# EAGLE design motor_servo_control (EAGLE 9.6.2)
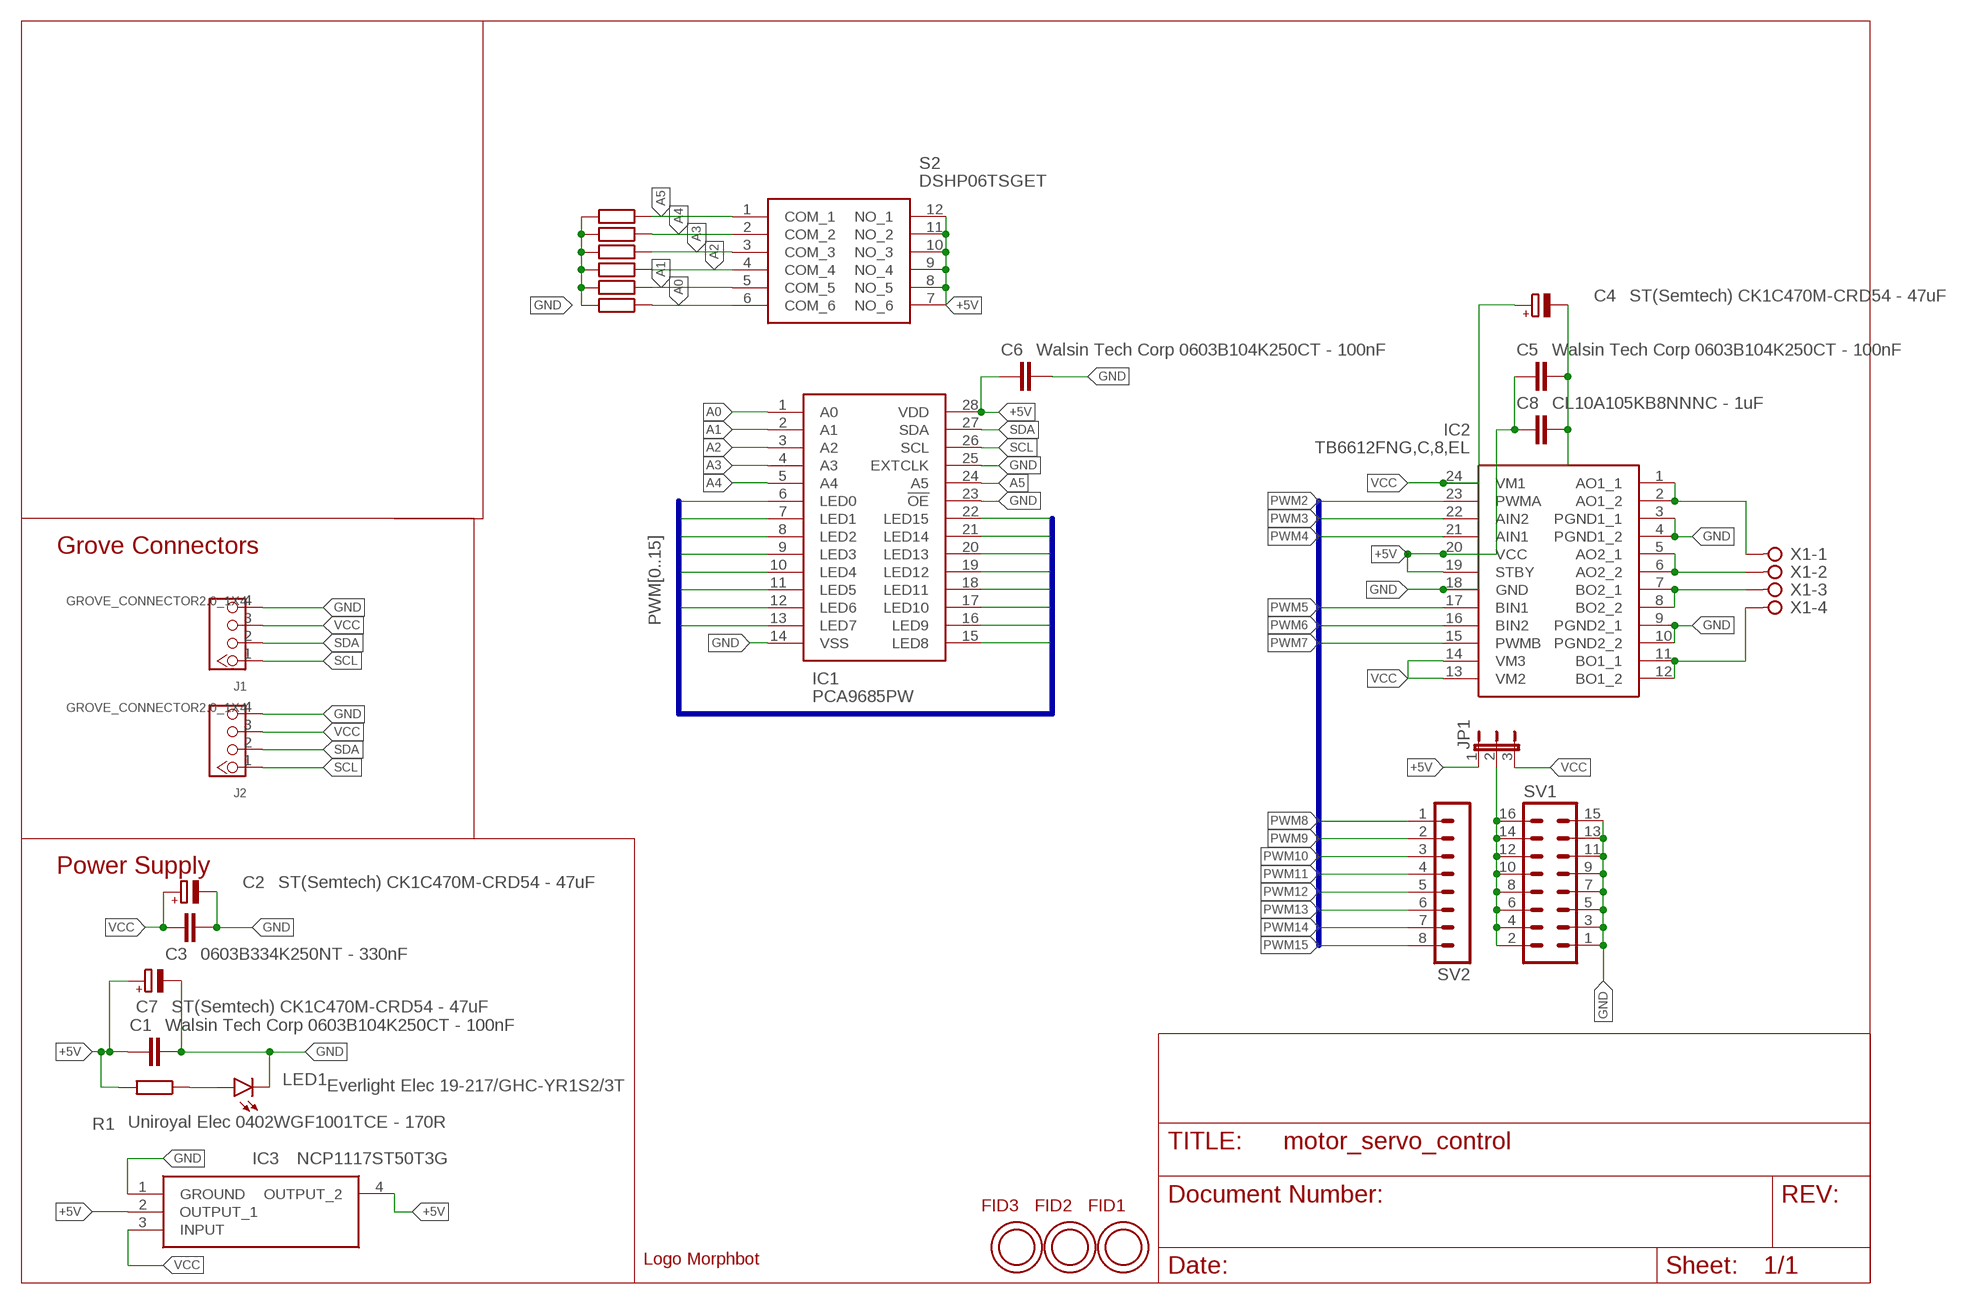
[diagram p0: schematic, sheet 1]

## Parts
C1  Walsin Tech Corp 0603B104K250CT - 100nF  C-EUC0603  [C0603]
C2  ST(Semtech) CK1C470M-CRD54 - 47uF  CPOL-EUC  [PANASONIC_C]
C3  0603B334K250NT - 330nF  C-EUC0603  [C0603]
C4  ST(Semtech) CK1C470M-CRD54 - 47uF  CPOL-EUC  [PANASONIC_C]
C5  Walsin Tech Corp 0603B104K250CT - 100nF  C-EUC0603  [C0603]
C6  Walsin Tech Corp 0603B104K250CT - 100nF  C-EUC0603  [C0603]
C7  ST(Semtech) CK1C470M-CRD54 - 47uF  CPOL-EUC  [PANASONIC_C]
C8  CL10A105KB8NNNC - 1uF  C-EUC0603  [C0603]
FID1  OPEN-PNP-FIDUCIAL  [OPEN-PNP-FIDUCIAL]
FID2  OPEN-PNP-FIDUCIAL  [OPEN-PNP-FIDUCIAL]
FID3  OPEN-PNP-FIDUCIAL  [OPEN-PNP-FIDUCIAL]
IC1  PCA9685PW  [SOP65P640X110-28N]
IC2  TB6612FNG,C,8,EL  [SOP65P760X160-24N]
IC3  NCP1117ST50T3G  [SOT230P700X180-4N]
J1  GROVE_CONNECTOR2.0_1X4  [2.0_1X4_STRAIGHT]
J2  GROVE_CONNECTOR2.0_1X4  [2.0_1X4_STRAIGHT]
JP1  JP2E  [JP2]
LED1  Everlight Elec 19-217/GHC-YR1S2/3T  LEDCHIPLED_0603  [CHIPLED_0603]
R1  Uniroyal Elec 0402WGF1001TCE - 170R  R-EU_R0402  [R0402]
R2  0402WGF1002TCE - 10k  R-EU_R0402  [R0402]
R3  0402WGF1002TCE - 10k  R-EU_R0402  [R0402]
R4  0402WGF1002TCE - 10k  R-EU_R0402  [R0402]
R5  0402WGF1002TCE - 10k  R-EU_R0402  [R0402]
R6  0402WGF1002TCE - 10k  R-EU_R0402  [R0402]
R7  0402WGF1002TCE - 10k  R-EU_R0402  [R0402]
S2  DSHP06TSGET  [DSHP06TSGET]
SV1  MA08-2  [MA08-2]
SV2  MA08-1  [MA08-1]
U$1  LOGO_MORPHBOT5MM  [LOGO_MORPHBOT]
X1  W237-04P  [W237-4P]

## Nets
+5V: C1.1 C5.1 C6.1 C7.+ C8.1 IC1.28(VDD) IC2.19(STBY) IC2.20(VCC) IC3.2(OUTPUT_1) IC3.4(OUTPUT_2) JP1.1 R1.2 S2.7(NO_6) S2.8(NO_5) S2.9(NO_4) S2.10(NO_3) S2.11(NO_2) S2.12(NO_1)
A0: IC1.1(A0) R7.1 S2.6(COM_6)
A1: IC1.2(A1) R6.1 S2.5(COM_5)
A2: IC1.3(A2) R5.1 S2.4(COM_4)
A3: IC1.4(A3) R4.1 S2.3(COM_3)
A4: IC1.5(A4) R3.1 S2.2(COM_2)
A5: IC1.24(A5) R2.1 S2.1(COM_1)
GND: C1.2 C2.- C3.1 C4.- C5.2 C6.2 C7.- C8.2 IC1.14(VSS) IC1.23(!OE) IC1.25(EXTCLK) IC2.3(PGND1_1) IC2.4(PGND1_2) IC2.9(PGND2_1) IC2.10(PGND2_2) IC2.18(GND) IC3.1(GROUND) J1.4 J2.4 LED1.C R2.2 R3.2 R4.2 R5.2 R6.2 R7.2 SV1.1 SV1.3 SV1.5 SV1.7 SV1.9 SV1.11 SV1.13 SV1.15
M1+: IC2.1(AO1_1) IC2.2(AO1_2) X1.1
M1-: IC2.5(AO2_1) IC2.6(AO2_2) X1.2
M2+: IC2.7(BO2_1) IC2.8(BO2_2) X1.3
M2-: IC2.11(BO1_1) IC2.12(BO1_2) X1.4
N$1: LED1.A R1.1
N$2: JP1.2 SV1.2 SV1.4 SV1.6 SV1.8 SV1.10 SV1.12 SV1.14 SV1.16
PWM0: IC1.6(LED0)
PWM1: IC1.7(LED1)
PWM2: IC1.8(LED2) IC2.23(PWMA)
PWM3: IC1.9(LED3) IC2.22(AIN2)
PWM4: IC1.10(LED4) IC2.21(AIN1)
PWM5: IC1.11(LED5) IC2.17(BIN1)
PWM6: IC1.12(LED6) IC2.16(BIN2)
PWM7: IC1.13(LED7) IC2.15(PWMB)
PWM8: IC1.15(LED8) SV2.1
PWM9: IC1.16(LED9) SV2.2
PWM10: IC1.17(LED10) SV2.3
PWM11: IC1.18(LED11) SV2.4
PWM12: IC1.19(LED12) SV2.5
PWM13: IC1.20(LED13) SV2.6
PWM14: IC1.21(LED14) SV2.7
PWM15: IC1.22(LED15) SV2.8
SCL: IC1.26(SCL) J1.1 J2.1
SDA: IC1.27(SDA) J1.2 J2.2
VCC: C2.+ C3.2 C4.+ IC2.13(VM2) IC2.14(VM3) IC2.24(VM1) IC3.3(INPUT) J1.3 J2.3 JP1.3

## Buses
PWM[0..15]
PWM0,PWM1,PWM2,PWM3,PWM4,PWM5,PWM6,PWM7,PWM8,PWM9,PWM10,PWM11,PWM12,PWM13,PWM14,PWM15

## Notes on the sheet
- Grove Connectors
- Power Supply

## Library data of the parts
C1 C3 C5 C6 C8 = rcl:C-EU: CAPACITOR, European symbol; SPICEPREFIX: C
C2 C4 C7 = rcl:CPOL-EU: POLARIZED CAPACITOR, European symbol; SPICEPREFIX: C
FID1-FID3 = topo-eng:OPEN-PNP-FIDUCIAL
IC1 = samacsys:PCA9685PW: LED DRIVER, RGBA, 28-TSSOP Source: Datasheet <http://docs-asia.electrocomponents.com/webdocs/0f65/0900766b80f65101.pdf>; DESCRIPTION: LED DRIVER, RGBA, 28-TSSOP; HEIGHT: 1.1mm; MANUFACTURER_NAME: Nexperia; MANUFACTURER_PART_NUMBER: PCA9685PW; MOUSER_PART_NUMBER: N/A; MOUSER_PRICE-STOCK: https://www.mouser.com/Search/Refine.aspx?Keyword=N%2FA
IC2 = samacsys:TB6612FNG,C,8,EL: otor / Motion / Ignition Controllers & Drivers Brush Motor Driver IC Source: Datasheet <http://toshiba.semicon-storage.com/info/docget.jsp?did=10660&prodName=TB6612FNG>; ARROW_PART_NUMBER: TB6612FNG,C,8,EL; ARROW_PRICE-STOCK: https://www.arrow.com/en/products/tb6612fngc8el/toshiba; DESCRIPTION: otor / Motion / Ignition Controllers & Drivers Brush Motor Driver IC; HEIGHT: 1.6mm; MANUFACTURER_NAME: Toshiba; MANUFACTURER_PART_NUMBER: TB6612FNG,C,8,EL; MOUSER_PART_NUMBER: 757-TB6612FNGC8EL; MOUSER_PRICE-STOCK: https://www.mouser.co.uk/ProductDetail/Toshiba/TB6612FNGC8EL?qs=rsevcuukUAy2UalRuv4E%2FQ%3D%3D
IC3 = samacsys:NCP1117ST50T3G: ON SEMICONDUCTOR - NCP1117ST50T3G - LDO, REG, 20VIN, 1A, 5V, 1%, SOT223-3 Source: Datasheet <http://www.onsemi.com/pub/Collateral/NCP1117-D.PDF>; ARROW_PART_NUMBER: NCP1117ST50T3G; ARROW_PRICE-STOCK: https://www.arrow.com/en/products/ncp1117st50t3g/on-semiconductor; DESCRIPTION: ON SEMICONDUCTOR - NCP1117ST50T3G - LDO, REG, 20VIN, 1A, 5V, 1%, SOT223-3; HEIGHT: 1.8mm; MANUFACTURER_NAME: ON Semiconductor; MANUFACTURER_PART_NUMBER: NCP1117ST50T3G; MOUSER_PART_NUMBER: 863-NCP1117ST50T3G; MOUSER_PRICE-STOCK: https://www.mouser.co.uk/ProductDetail/ON-Semiconductor/NCP1117ST50T3G?qs=Gev%252BmEvV0ib6dijy6U0dhQ%3D%3D
J1 J2 = morphbot:GROVE_CONNECTOR: Seeedstudio Grove-Connector: 1 = SCL 2 = SDA 3 = VCC 4 = GND
JP1 = jumper:JP2E: JUMPER
LED1 = led:LED: LED OSRAM: - CHIPLED LG R971, LG N971, LY N971, LG Q971, LY Q971, LO R971, LY R971 LH N974, LH R974 LS Q976, LO Q976, LY Q976 LO Q996 - Hyper CHIPLED LW Q18S LB Q993, LB Q99A, LB R99A - SideLED LS A670, LO A670, LY A670, LG A670, LP A670 LB A673, LV A673, LT A673, LW A673 LH A674 LY A675 LS A676, LA A676, LO A676, LY A676, LW A676 LS A679, LY A679, LG A679 - Hyper Micro SIDELED® LS Y876, LA Y876, LO Y876, LY Y876 LT Y87S - SmartLED LW L88C, LW L88S LB L89C, LB L89S, LG L890 LS L89K, LO L89K, LY L89K LS L896, LA L896, LO L896, LY L896 - TOPLED LS T670, LO T670, LY T670, LG T670, LP T670 LSG T670, LSP T670, LSY T670, LOP T670, LYG T670 LG T671, LOG T671, LSG T671 LB T673, LV T673, LT T673, LW T673 LH T674 LS T676, LA T676, LO T676, LY T676, LB T676, LH T676, LSB T676, LW T676 LB T67C, LV T67C, LT T67C, LS T67K, LO T67K, LY T67K, LW E67C LS E67B, LA E67B, LO E67B, LY E67B, LB E67C, LV E67C, LT E67C LW T67C LS T679, LY T679, LG T679 LS T770, LO T770, LY T770, LG T770, LP T770 LB T773, LV T773, LT T773, LW T773 LH T774 LS E675, LA E675, LY E675, LS T675 LS T776, LA T776, LO T776, LY T776, LB T776 LHGB T686 LT T68C, LB T68C - Hyper Mini TOPLED® LB M676 - Mini TOPLED Santana® LG M470 LS M47K, LO M47K, LY M47K Source: http://www.osram.convergy.de LUXEON: - LUMILED® LXK2-PW12-R00, LXK2-PW12-S00, LXK2-PW14-U00, LXK2-PW14-V00 LXK2-PM12-R00, LXK2-PM12-S00, LXK2-PM14-U00 LXK2-PE12-Q00, LXK2-PE12-R00, LXK2-PE12-S00, LXK2-PE14-T00, LXK2-PE14-U00 LXK2-PB12-K00, LXK2-PB12-L00, LXK2-PB12-M00, LXK2-PB14-N00, LXK2-PB14-P00, LXK2-PB14-Q00 LXK2-PR12-L00, LXK2-PR12-M00, LXK2-PR14-Q00, LXK2-PR14-R00 LXK2-PD12-Q00, LXK2-PD12-R00, LXK2-PD12-S00 LXK2-PH12-R00, LXK2-PH12-S00 LXK2-PL12-P00, LXK2-PL12-Q00, LXK2-PL12-R00 Source: www.luxeon.com KINGBRIGHT: KA-3528ASYC Source: www.kingbright.com
R1-R7 = rcl:R-EU_: RESISTOR, European symbol; SPICEPREFIX: R
S2 = samacsys:DSHP06TSGET: SPST 6 1.27mm, Half Slide (Standard) Black SMD DIP Switches Source: Datasheet <https://datasheet.lcsc.com/szlcsc/1810191313_Dongguan-Guangzhu-Industrial-DSHP06TSGET_C40737.pdf>; DESCRIPTION: SPST 6 1.27mm, Half Slide (Standard) Black SMD DIP Switches; HEIGHT: 2.6mm; MANUFACTURER_NAME: Dongguan Guangzhu Industrial; MANUFACTURER_PART_NUMBER: DSHP06TSGET
SV1 = con-lstb:MA08-2: PIN HEADER; OC_FARNELL: unknown; OC_NEWARK: unknown
SV2 = con-lstb:MA08-1: PIN HEADER; OC_FARNELL: unknown; OC_NEWARK: unknown
U$1 = topo-eng:LOGO_MORPHBOT
X1 = con-wago-508:W237-04P: WAGO SREW CLAMP; OC_FARNELL: unknown; OC_NEWARK: unknown

## Board
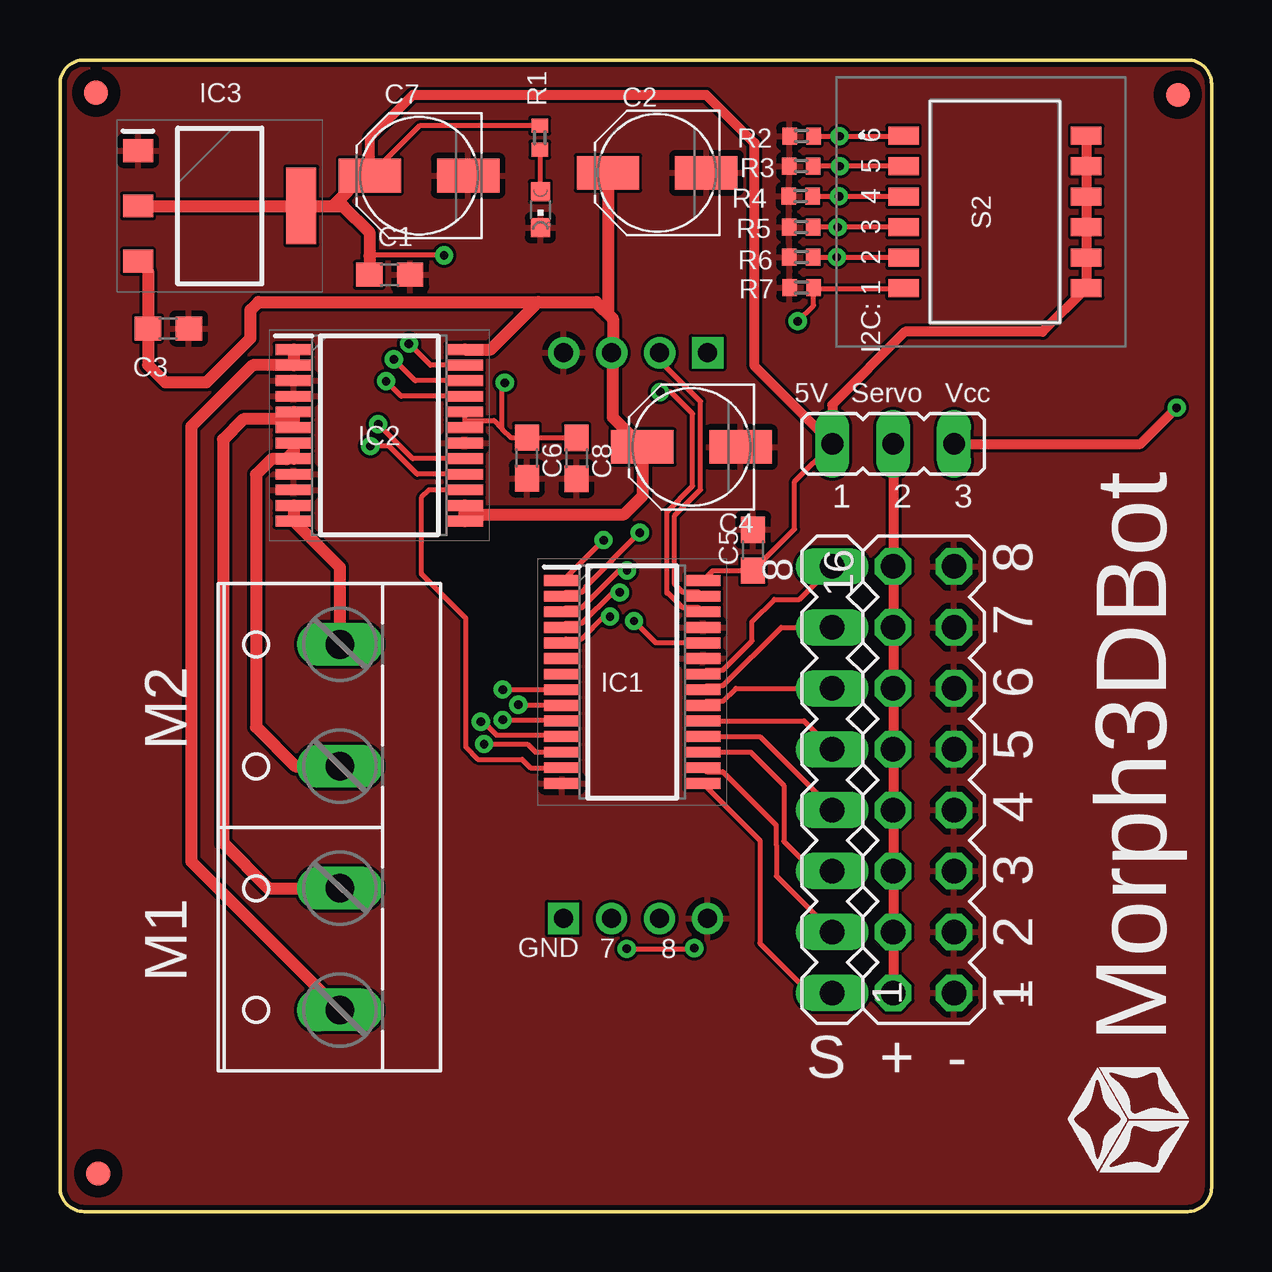
[diagram p1: board, top side]
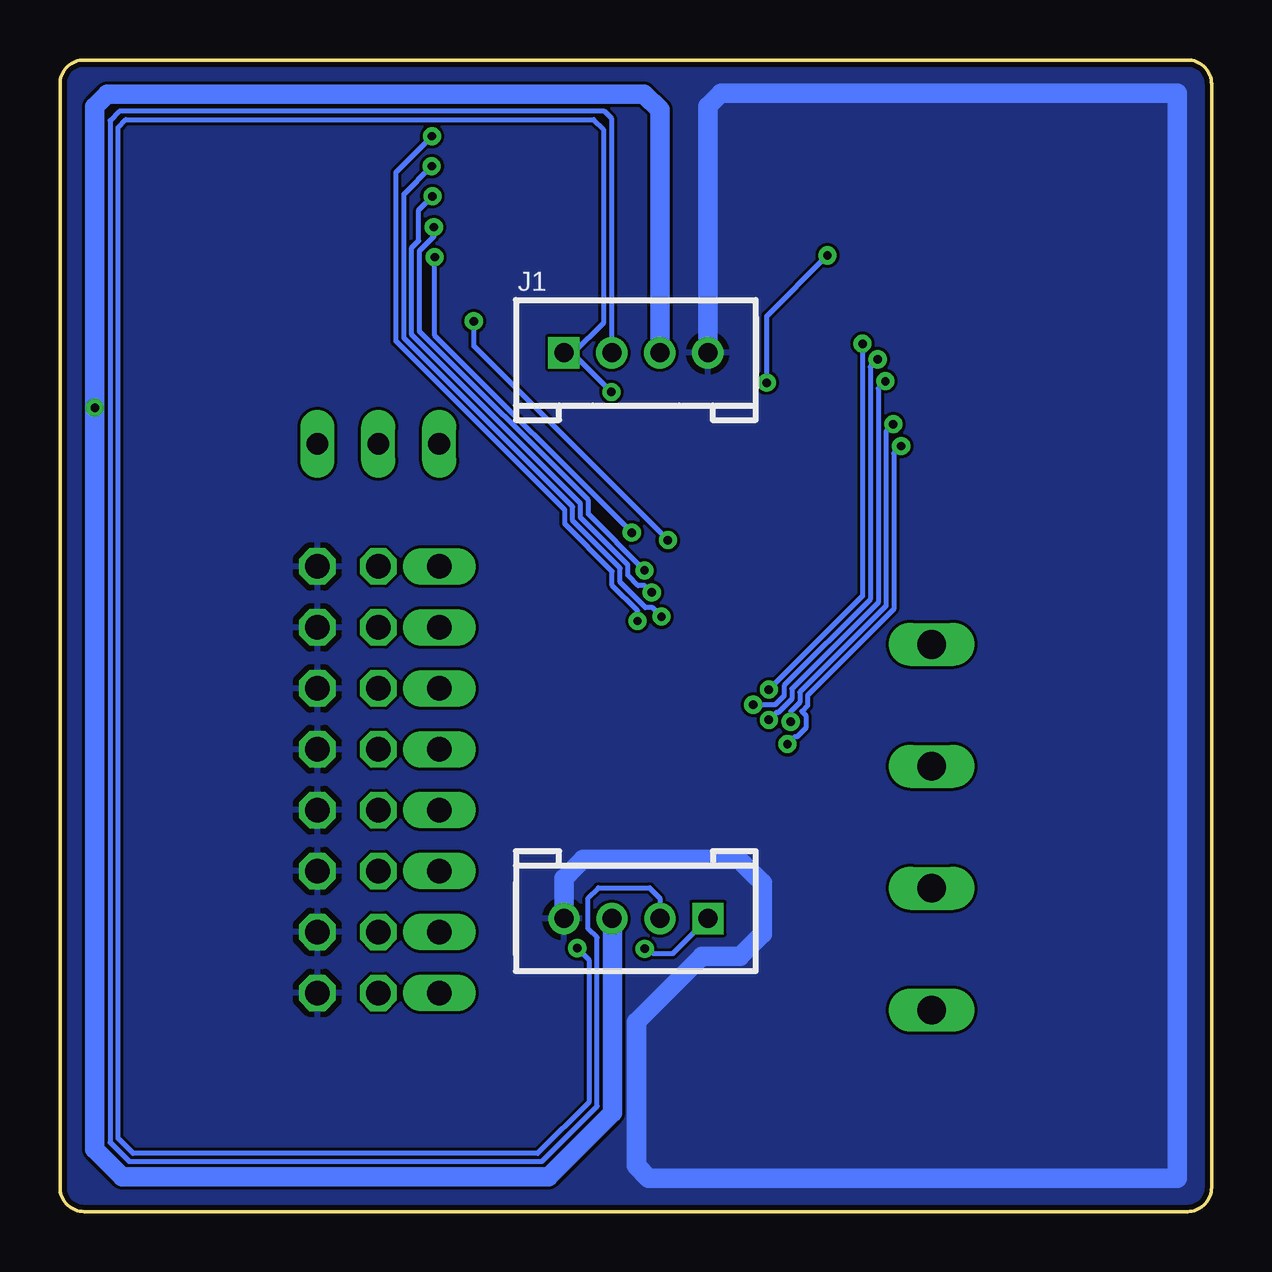
[diagram p2: board, bottom side, seen from below]

Size 48 x 48 mm. Coordinates in mm from the lower left corner, seen from the top.
Outline: 47,0 1,0 arc-90 0,1 0,47 arc-90 1,48 47,48 arc-90 48,47 48,1 arc-90 47,0
Copper layers (1*16): Top 0.035mm / dielectric 0.2mm / Bottom 0.035mm
Design rules "jlcpcb_4_layer *": minimum track width 3.5mil, minimum drill 0.2mm, track to track 5mil, track to pad 6mil, pad to pad 6mil, via to via 6mil, smd to smd 6mil, copper to edge 0.2mm, drill to drill 6mil, minimum pad ring 10mil, minimum via ring 8mil, stop-mask expansion 4mil, vias tented up to drill 0mil, thermal gap 10mil
bKeepout: area 24,0 to 48,48; area 0,0 to 24,48

### Footprints (pad centres in the part's own frame; a part is rotated, then mirrored left to right if it is on the bottom)
C0603 = smd 1.1 x 1: 1 -0.85,0; 2 0.85,0
PANASONIC_C = smd 2.6 x 1.4: + 2.05,0; - -2.05,0
OPEN-PNP-FIDUCIAL = smd 1 x 1: FID$1 0,0
SOP65P640X110-28N = smd 1.475 x 0.45: 1 -2.938,4.225; 2 -2.938,3.575; 3 -2.938,2.925; 4 -2.938,2.275; 5 -2.938,1.625; 6 -2.938,0.975; 7 -2.938,0.325; 8 -2.938,-0.325; 9 -2.938,-0.975; 10 -2.938,-1.625; 11 -2.938,-2.275; 12 -2.938,-2.925; 13 -2.938,-3.575; 14 -2.938,-4.225; 15 2.938,-4.225; 16 2.938,-3.575; 17 2.938,-2.925; 18 2.938,-2.275; 19 2.938,-1.625; 20 2.938,-0.975; 21 2.938,-0.325; 22 2.938,0.325; 23 2.938,0.975; 24 2.938,1.625; 25 2.938,2.275; 26 2.938,2.925; 27 2.938,3.575; 28 2.938,4.225
SOP65P760X160-24N = smd 1.525 x 0.45: 1 -3.562,3.575; 2 -3.562,2.925; 3 -3.562,2.275; 4 -3.562,1.625; 5 -3.562,0.975; 6 -3.562,0.325; 7 -3.562,-0.325; 8 -3.562,-0.975; 9 -3.562,-1.625; 10 -3.562,-2.275; 11 -3.562,-2.925; 12 -3.562,-3.575; 13 3.562,-3.575; 14 3.562,-2.925; 15 3.562,-2.275; 16 3.562,-1.625; 17 3.562,-0.975; 18 3.562,-0.325; 19 3.562,0.325; 20 3.562,0.975; 21 3.562,1.625; 22 3.562,2.275; 23 3.562,2.925; 24 3.562,3.575
SOT230P700X180-4N = smd 1.25 x 0.95: 1 -3.4,2.3; 2 -3.4,0; 3 -3.4,-2.3 | smd 1.25 x 3.2: 4 3.4,0
2.0_1X4_STRAIGHT = drill 0.8 pad 1.27 square: 1 1.83,-1.786 | drill 0.8 pad 1.27: 2 3.83,-1.786; 3 5.83,-1.786; 4 7.83,-1.786
JP2 = drill 0.914 long: 1 -2.54,0; 2 0,0; 3 2.54,0
CHIPLED_0603 = smd 0.8 x 0.8: A 0,-0.75; C 0,0.75
R0402 = smd 0.6 x 0.7: 1 -0.5,0; 2 0.5,0
DSHP06TSGET = smd 0.76 x 1.27: 1 -3.175,-3.81; 2 -1.905,-3.81; 3 -0.635,-3.81; 4 0.635,-3.81; 5 1.905,-3.81; 6 3.175,-3.81; 7 3.175,3.81; 8 1.905,3.81; 9 0.635,3.81; 10 -0.635,3.81; 11 -1.905,3.81; 12 -3.175,3.81
MA08-2 = drill 1.016 octagon: 1 -8.89,-1.27; 2 -8.89,1.27; 3 -6.35,-1.27; 4 -6.35,1.27; 5 -3.81,-1.27; 6 -3.81,1.27; 7 -1.27,-1.27; 8 -1.27,1.27; 9 1.27,-1.27; 10 1.27,1.27; 11 3.81,-1.27; 12 3.81,1.27; 13 6.35,-1.27; 14 6.35,1.27; 15 8.89,-1.27; 16 8.89,1.27
MA08-1 = drill 1.016 long: 1 -8.89,0; 2 -6.35,0; 3 -3.81,0; 4 -1.27,0; 5 1.27,0; 6 3.81,0; 7 6.35,0; 8 8.89,0
W237-4P = drill 1.194 long: 1 -7.62,-0.635; 2 -2.54,-0.635; 3 2.54,-0.635; 4 7.62,-0.635

### Placement (x,y rotation side)
C1  13.74,39.04 0 top
C2  24.89,43.29 180 top
C3  4.52,36.81 180 top
C4  26.32,31.87 180 top
C5  28.89,27.57 90 top
C6  19.46,31.41 270 top
C7  14.97,43.18 180 top
C8  21.53,31.39 270 top
FID1  1.59,1.59 0 top
FID2  1.5,46.64 0 top
FID3  46.6,46.55 0 top
IC1  23.85,22.07 0 top
IC2  13.31,32.36 0 top
IC3  6.66,41.92 0 top
J1  28.83,37.58 0 bottom
J2  19.16,10.43 180 bottom
JP1  34.73,32 0 top
LED1  20.03,41.76 180 top
R1  20,44.76 90 top
R2  30.91,44.82 180 top
R3  30.9,43.58 180 top
R4  30.88,42.32 180 top
R5  30.9,41.03 180 top
R6  30.9,39.78 180 top
R7  30.91,38.51 180 top
S2  38.97,41.67 270 top
SV1  36,18 90 top
SV2  32.19,18 90 top
U$1  47.31,1.08 90 top
X1  11.03,16.02 90 top

### Tracks (layer width: path | path; a pad name or v marks a point on that pad's centre or on a via)
+5V  (via drill 0.35)
  Top 0.2: R1.2 19.99,45.27 15.01,45.27 C7.+ | C8.1 19.48,32.24 C6.1 18.8,32.26 18.43,32.62 | IC2.20 16.87,32.97 | 16.87,32.97 IC2.19 | 16.87,32.97 18.09,32.97 18.43,32.62 | 18.43,32.62 18.43,34.45 v18.54,34.55 | v16.01,39.85 12.92,39.85 12.9,39.84 | IC1.28 27.21,26.72 C5.1 30.62,28.45 30.62,30.43 JP1.1
  Top 0.3: 9.97,41.91 IC3.4
  Top 0.406: S2.12 S2.11 S2.10 S2.9 S2.8 S2.7 40.95,36.67 35.22,36.67 32.19,33.63 JP1.1 28.95,35.24 28.95,44.53 26.95,46.54 14.7,46.54 12.92,44.75 C7.+
  Top 0.5: C7.+ 12.64,43.18 11.38,41.91 IC3.4 11.81,41.91 12.9,40.82 12.9,39.84 12.9,39.05 C1.1 | 9.97,41.91 10.22,41.67 9.97,41.91 | IC3.2 9.97,41.91
  Bottom 0.2: v18.54,34.55 18.54,37.33 v16.01,39.85
A0  (via drill 0.35)
  Top 0.2: IC1.1 20.98,26.3 v22.66,27.98 | v30.75,37.11 31.41,37.77 31.41,38.45 | 31.41,38.45 R7.1 | S2.6 35.12,38.45 31.41,38.45
  Bottom 0.2: v22.66,27.98 30.75,36.07 v30.75,37.11
A1  (via drill 0.35)
  Top 0.2: IC1.2 21.09,25.82 21.76,25.82 21.91,25.97 21.91,26.04 v24.16,28.3 | R6.1 v32.38,39.78 35.14,39.78 S2.5
  Bottom 0.2: v24.16,28.3 32.38,36.51 v32.38,39.78
A2  (via drill 0.35)
  Top 0.2: S2.4 v32.42,41.03 R5.1 | IC1.3 21.09,25.17 21.76,25.17 23.31,26.72 v23.64,26.72
  Bottom 0.2: v23.64,26.72 25.98,29.07 25.98,29.65 33.01,36.68 33.01,40.04 32.42,40.63 v32.42,41.03
A3  (via drill 0.35)
  Top 0.2: R4.1 v32.48,42.32 35.14,42.32 S2.3 | IC1.4 21.09,24.52 21.76,24.52 23.04,25.81 v23.34,25.81
  Bottom 0.2: v23.34,25.81 23.62,26.09 23.9,26.09 24.33,26.52 24.33,26.95 26.3,28.93 26.3,29.51 33.34,36.55 33.34,40.18 33.05,40.47 33.05,41.74 v32.48,42.32
A4  (via drill 0.35)
  Top 0.2: S2.2 v32.51,43.57 R3.1 | IC1.5 21.09,23.87 21.76,23.87 22.68,24.8 v22.93,24.8
  Bottom 0.2: v22.93,24.8 23.3,25.18 23.6,25.18 24.66,26.23 24.66,26.82 26.63,28.79 26.63,29.38 33.66,36.41 33.66,42.41 v32.51,43.57
A5  (via drill 0.35)
  Top 0.2: R2.1 v32.49,44.82 35.14,44.82 S2.1 | IC1.24 24.84,23.7 v23.93,24.61
  Bottom 0.2: v23.93,24.61 23.93,25.04 24.98,26.1 24.98,26.68 26.96,28.66 26.96,29.24 33.99,36.28 33.99,43.32 v32.49,44.82
GND
  Top 0.5: C7.- 16.4,43.18
  Bottom 0.813: J1.4 21,46.07 20.45,46.61 1.42,46.61 1.42,1.39 23.46,1.39 23.98,1.9 23.98,7.9 21.23,10.64 19.65,10.64 18.72,11.57 18.72,13.7 19.7,14.68 26.2,14.68 26.99,13.89 J2.4
  pour Bottom: 1,0 arc-90 0,1 0,47 arc-90 1,48 47,48 arc-90 48,47 48,1 arc-90 47,0
  pour Top: 1,0 arc-90 0,1 0,47 arc-90 1,48 47,48 arc-90 48,47 48,1 arc-90 47,0
M1+
  Top 0.508: IC2.1 IC2.2 8.03,35.28 5.47,32.72 5.47,14.59 X1.1
M1-
  Top 0.508: IC2.5 9.74,33.03 | 9.74,33.03 IC2.6 | 9.74,33.03 7.64,33.03 6.8,32.18 6.8,15.36 8.68,13.48 X1.2
M2+
  Top 0.508: IC2.7 9.74,31.67 | 9.74,31.67 IC2.8 | 9.74,31.67 9.44,31.36 8.81,31.36 8.18,30.73 8.18,20.19 9.81,18.56 X1.3
M2-
  Top 0.508: IC2.11 IC2.12 11.66,26.86 X1.4
N$1
  Top 0.2: R1.1 20,42.54 LED1.A
N$2
  Top 0.406: JP1.2 SV1.16 SV1.14 SV1.12 SV1.10 SV1.8 SV1.6 SV1.4 SV1.2
PWM2  (via drill 0.35)
  Top 0.2: IC2.23 15.44,35.28 v14.55,36.17 | v18.45,21.75 IC1.8
  Bottom 0.2: v14.55,36.17 14.55,25.66 v18.45,21.75
PWM3  (via drill 0.35)
  Top 0.2: IC2.22 14.81,34.63 v13.92,35.52 | v19.11,21.12 20.89,21.12 IC1.9
  Bottom 0.2: v13.92,35.52 14.22,35.22 14.22,25.52 17.82,21.92 17.82,21.49 18.19,21.12 v19.11,21.12
PWM4  (via drill 0.35)
  Top 0.2: IC2.21 14.22,33.98 v13.59,34.61 | v18.45,20.49 20.87,20.49 IC1.10
  Bottom 0.2: v13.59,34.61 13.89,34.31 13.89,25.38 17.49,21.79 17.49,21.36 18.05,20.8 18.15,20.8 v18.45,20.49
PWM5  (via drill 0.35)
  Top 0.2: IC2.17 14.7,31.38 v13.27,32.82 | v17.54,20.42 17.63,20.42 18.19,19.86 20.85,19.86 IC1.11
  Bottom 0.2: v13.27,32.82 13.57,32.51 13.57,25.25 17.17,21.65 17.17,21.22 17.54,20.85 v17.54,20.42
PWM6  (via drill 0.35)
  Top 0.2: IC2.16 14.89,30.73 13.71,31.91 v12.94,31.91 | v17.68,19.48 19.48,19.48 19.82,19.15 IC1.12
  Bottom 0.2: v12.94,31.91 13.24,31.61 13.24,25.11 16.84,21.52 16.84,21.09 17.08,20.85 16.91,20.68 16.91,20.16 17.28,19.79 17.37,19.79 v17.68,19.48
PWM7
  Top 0.2: IC2.15 15.38,30.08 15.06,29.76 15.06,26.59 16.91,24.74 16.91,19.36 17.41,18.85 19.27,18.85 19.62,18.5 IC1.13
PWM8
  Top 0.2: IC1.15 29.17,15.47 29.17,11.18 31.24,9.11 SV2.1
PWM9
  Top 0.2: IC1.16 26.96,18.33 27.64,18.33 29.85,16.11 29.85,15.29 29.86,15.28 29.86,13.98 SV2.2
PWM10
  Top 0.2: IC1.17 28.79,19.15 30.18,17.76 30.18,15.43 31.41,14.19 SV2.3
PWM11
  Top 0.2: IC1.18 29.18,19.8 32.19,16.78 SV2.4
PWM12
  Top 0.2: IC1.19 31.01,20.45 SV2.5
PWM13
  Top 0.2: IC1.20 26.96,21.27 27.64,21.27 28.17,21.81 SV2.6
PWM14
  Top 0.2: IC1.21 26.96,21.92 27.64,21.92 30.06,24.35 SV2.7
PWM15
  Top 0.2: IC1.22 26.96,22.57 27.64,22.57 28.85,23.79 28.85,24.59 29.77,25.52 30.82,25.52 SV2.8
SCL  (via drill 0.35)
  Top 0.2: v26.44,10.98 26.43,10.95 v23.63,10.95 | IC1.26 26.62,25.17 25.95,25.17 25.34,25.78 25.3,25.78 25.3,29.17 26.37,30.24 26.37,33.25 25.47,34.16 v25.02,34.16
  Bottom 0.2: J2.1 22.46,10.74 23.26,10.74 v23.63,10.95 | v26.44,10.98 25.96,10.49 25.96,4.55 28.08,2.42 44.96,2.42 45.58,3.04 45.58,32.95 45.58,45.19 45.25,45.51 25.76,45.51 25.35,45.11 25.35,37.04 26.59,35.8 J1.1 26.66,35.8 v25.02,34.16
SDA
  Top 0.2: IC1.27 26.62,25.82 25.95,25.82 25.62,26.15 25.62,29.01 26.7,30.09 26.7,33.77 25,35.47 J1.2
  Bottom 0.2: J1.2 25,45.54 25.31,45.86 45.53,45.86 45.91,45.48 45.91,2.88 45.12,2.09 27.92,2.09 25.61,4.39 25.61,11.42 25.98,11.79 25.98,13.07 25.55,13.49 23.43,13.49 22.99,13.06 J2.2
VCC  (via drill 0.35)
  Top 0.406: JP1.3 45.04,32 v46.55,33.51
  Top 0.5: IC3.3 3.67,39.2 C3.2 3.67,35.29 4.39,34.56 6.11,34.56 7.95,36.4 7.95,37.58 8.28,37.91 19.94,37.91 22.35,37.91 23.04,37.22 | 23.04,37.22 23.04,35.85 J1.3 | C2.+ 22.84,37.42 23.04,37.22
  Top 0.508: IC2.13 16.87,29.12 | 16.87,29.12 IC2.14 | 16.87,29.12 16.93,29.06 23.5,29.06 24.29,29.85 24.29,31.85 C4.+ 23.04,33.1 23.04,35.85 | IC2.24 17.96,35.93 19.94,37.91
  Bottom 0.5: 24.97,12.2 J2.3
  Bottom 0.813: J1.3 23,45.92 23.65,46.57 46.02,46.57 46.55,46.05 v46.55,33.51 46.55,2.59 45.4,1.45 27.64,1.45 24.97,4.12 24.97,12.2

### Text on the board
tPlace: I2C: 1 2 3 4 5 6 | 5V Servo Vcc | M1 M2 | 1 2 3 4 5 6 7 8 | S + -
tNames: GND | 7 | 8